# EasyEDA Pro project triple-J UAV 原理图+PCB.epro, board PCB1
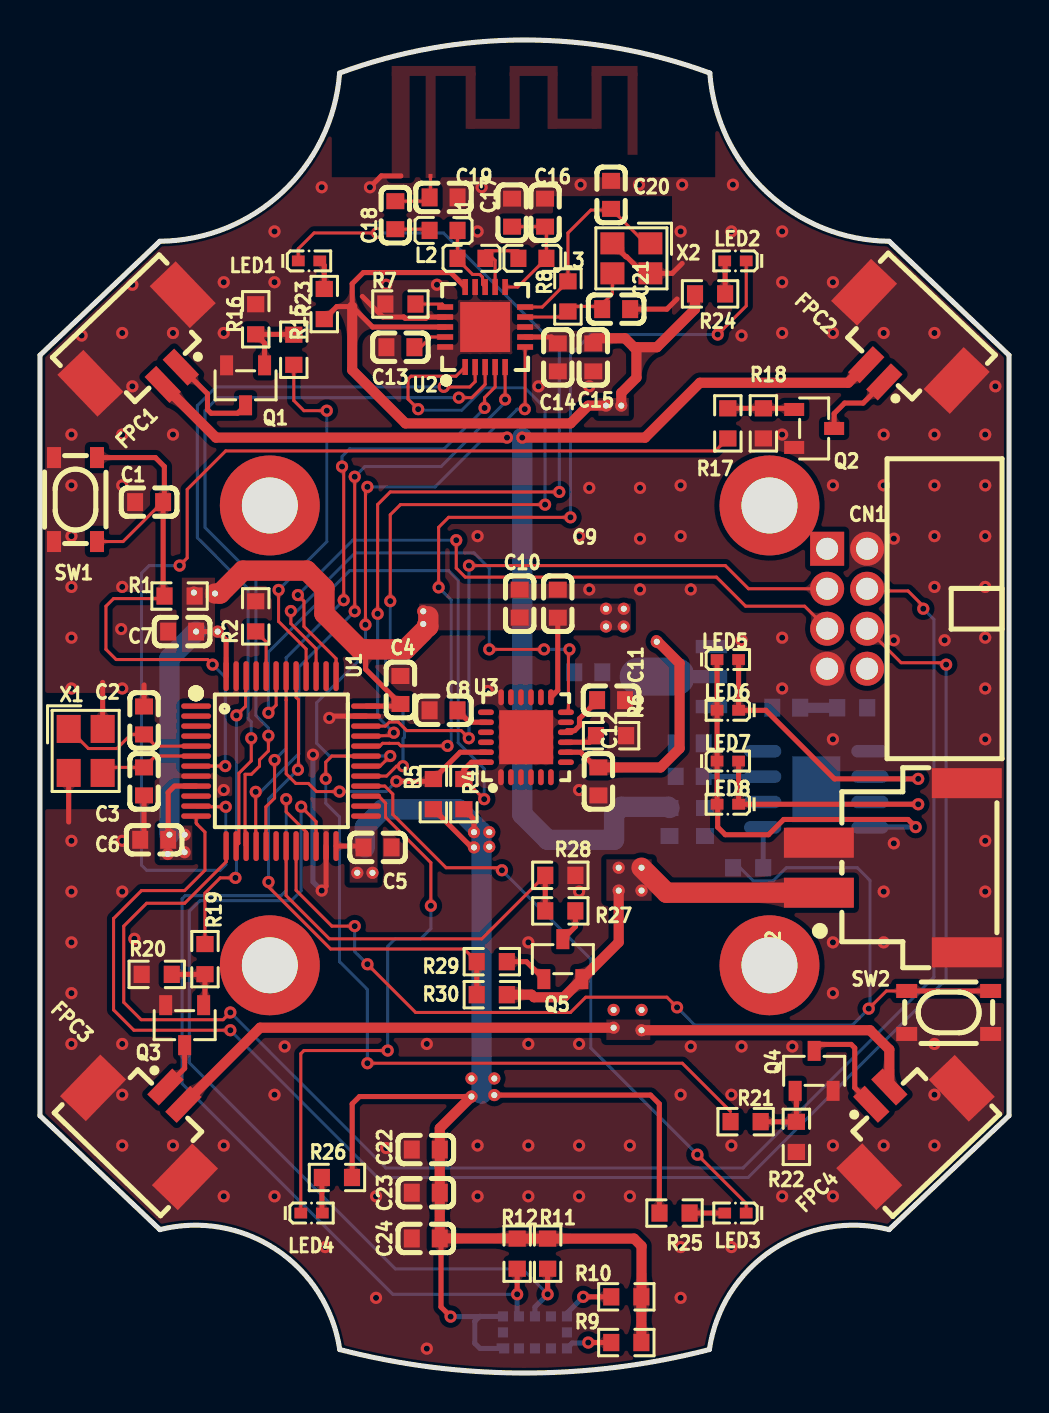
[diagram p13: board, top side]
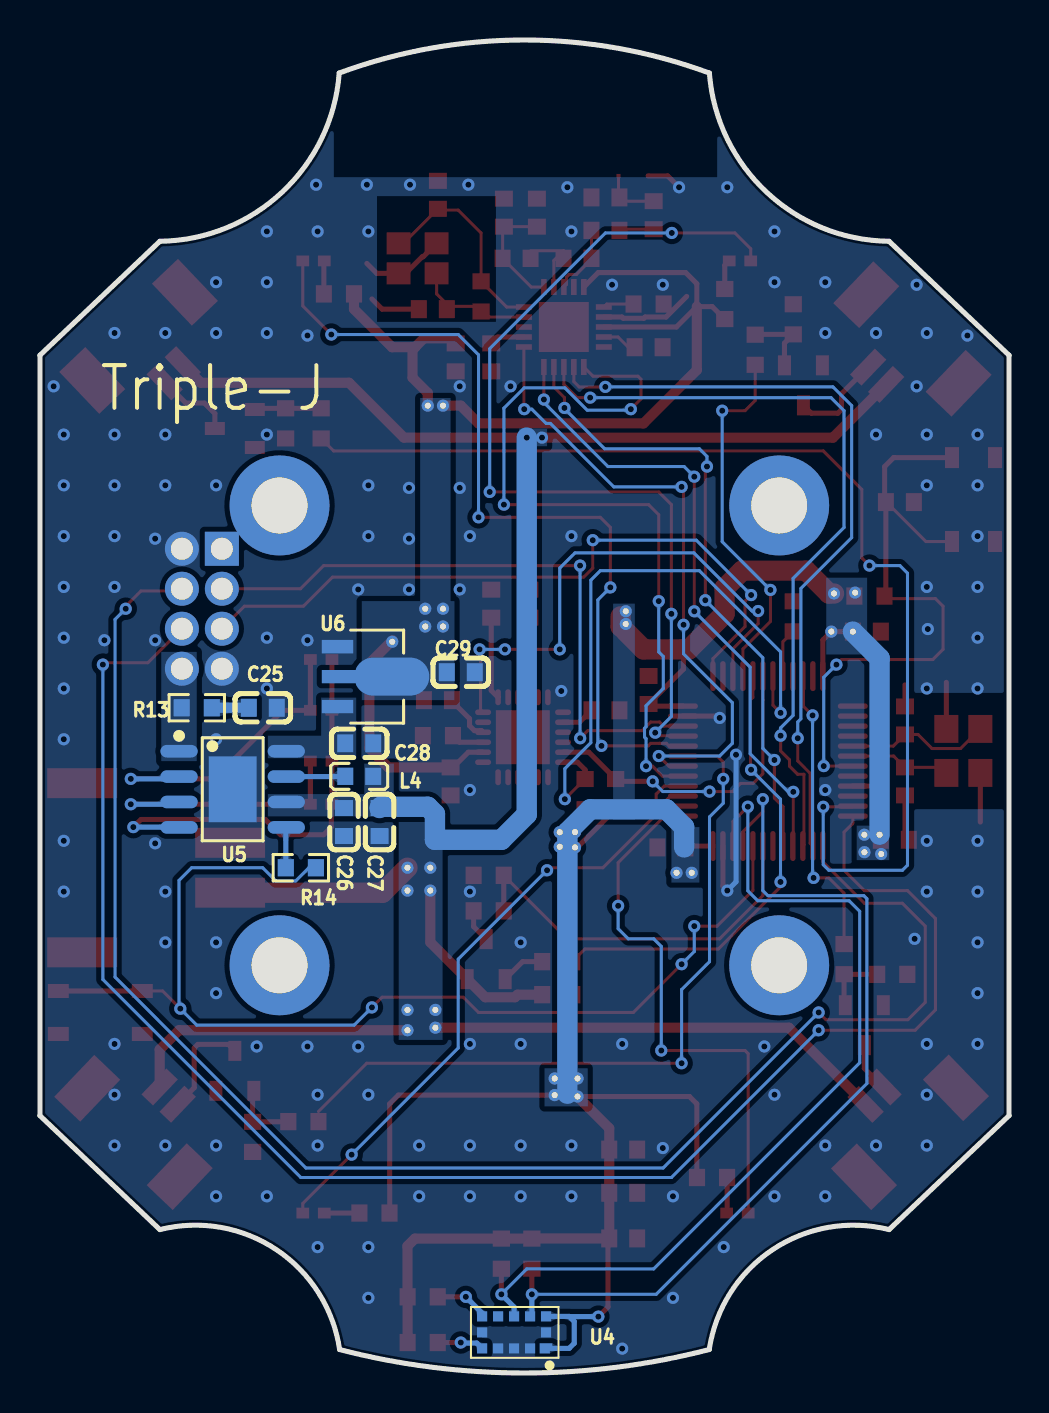
[diagram p14: board, bottom side, seen from below]

Outline 48.49 x 66.68 mm; copper layers: Top Layer, Bottom Layer. Coordinates in mm from the lower left corner of the outline.
Outline path: 0,50.91 6,56.61 arc(12.13,59.07) 14.99,65.02 arc(24.25,66.68) 33.51,65.02 arc(36.36,59.07) 42.49,56.61 48.49,50.91 48.49,12.87 42.49,7.17 arc(36.66,6.17) 33.49,1.17 arc(24.25,0) 15,1.17 arc(11.83,6.17) 6,7.17 0,12.87 0,50.91
Stack: Top Layer 0.035mm / Dielectric1 1.51mm FR4 er 4.5 / Bottom Layer 0.035mm

## Design rules (mm)
spacing copperThickness1oz (default): track to track 0.102, other pairs 0 to 0.3
spacing copperThickness2oz: track to track 0.203, other pairs 0.152 to 0.3
track width copperThickness1oz (default): min 0.127, default 0.254, max 2.54
track width copperThickness2oz: min 0.203, default 0.254, max 2.54
differential pair differentialPair (default): width min 0.127, default 0.254, max 2.54; gap min 0.152, default 0.152
via viaSize (default): diameter min 0.5, default 0.61, max 10; hole min 0.3, default 0.305, max 6.3

## Placement (name value [footprint] x y rotation side)
C1  100nF  [C0603]  5.46 43.56 0 top
C2  12pF  [C0603]  5.21 32.64 90 top
C3  12pF  [C0603]  5.21 29.59 90 top
C4  100nF  [C0603]  18.03 34.16 270 top
C5  100nF  [C0603]  16.89 26.29 180 top
C6  100nF  [C0603]  5.72 26.67 0 top
C7  100nF  [C0603]  7.11 37.08 0 top
C8  10nF  [C0603]  20.19 33.15 180 top
C9  100nF  [C0603]  25.91 38.48 90 top
C10  2.2uF  [C0603]  24 38.48 90 top
C11  100nF  [C0603]  28.57 33.66 180 top
C12  10nF  [C0603]  27.94 29.59 270 top
C13  33nF  [C0603]  18.03 51.31 0 top
C14  100nF  [C0603]  25.91 50.8 90 top
C15  10nF  [C0603]  27.69 50.8 90 top
C16  2.2nF  [C0603]  25.27 58.04 270 top
C17  4.7pF  [C0603]  23.62 58.04 270 top
C18  1.5pF  [C0603]  17.78 57.91 270 top
C19  1pF  [C0603]  20.19 58.8 0 top
C20  22pF  [C0603]  28.57 58.93 90 top
C21  22pF  [C0603]  28.83 53.21 180 top
C22  1pF  [C0603]  19.3 11.18 0 top
C23  100nF  [C0603]  19.3 9.02 0 top
C24  4.7uF  [C0603]  19.3 6.73 0 top
C25  2.2uF  [C0603]  37.34 33.27 180 bottom
C26  10uF  [C0603]  33.27 27.56 90 bottom
C27  10uF  [C0603]  31.5 27.56 90 bottom
C28  10uF  [C0603]  32.51 31.5 0 bottom
C29  10uF  [C0603]  27.43 35.05 180 bottom
CN1  3111-08RG0BK00T1  [CONN-TH_3111-08RG0BK00T1]  40.39 38.23 270 top
CN2  ZX-XH2.54-2PWT  [CONN-SMD_2P-P2.54_MEGASTAR_ZX-XH2.54-2PWT]  42.67 25.27 90 top
FPC1  1.25-2PWB  [CONN-SMD_2P-P1.25_DEALON_1.25-2PWB]  5.72 50.8 223.8 top
FPC2  1.25-2PWB  [CONN-SMD_2P-P1.25_DEALON_1.25-2PWB]  42.67 50.93 136.4 top
FPC3  1.25-2PWB  [CONN-SMD_2P-P1.25_DEALON_1.25-2PWB]  5.84 12.95 315.9 top
FPC4  1.25-2PWB  [CONN-SMD_2P-P1.25_DEALON_1.25-2PWB]  42.93 12.95 43.7 top
L1  3.9nH  [L0603]  20.19 57.15 180 top
L2  8.2nH  [L0603]  21.59 55.75 180 top
L3  2.7nH  [L0603]  24.64 55.75 0 top
L4  1.5uH  [L0603]  32.51 29.85 180 bottom
LED1  XL-1005UYC  [LED0402-FD_YELLOW]  13.46 55.63 180 top
LED2  XL-1005UYC  [LED0402-FD_YELLOW]  34.8 55.63 0 top
LED3  XL-1005UYC  [LED0402-FD_YELLOW]  34.8 8 0 top
LED4  XL-1005UYC  [LED0402-FD_YELLOW]  13.59 8 180 top
LED5  XL-1005UYC  [LED0402-FD_YELLOW]  34.42 35.69 180 top
LED6  XL-1005UYC  [LED0402-FD_YELLOW]  34.42 33.15 0 top
LED7  XL-1005UYC  [LED0402-FD_YELLOW]  34.42 30.61 180 top
LED8  XL-1005UYC  [LED0402-FD_YELLOW]  34.42 28.45 0 top
NOREF  -  [Pad_e605]  28.32 48.39 0 top
NOREF#2  -  [Pad_e420]  7.81 37.08 0 top
NOREF#3  -  [Pad_e526]  21.59 13.83 0 top
NOREF#4  -  [Pad_e929]  19.18 37.47 0 top
NOREF#5  -  [Pad_e520]  21.72 27.05 0 top
NOREF#6  -  [Pad_e416]  7.23 26.05 0 top
NOREF#7  -  [Pad_e434]  29.21 37.34 0 top
NOREF#8  -  [Pad_e415]  6.4 25.96 0 top
NOREF#9  -  [Pad_e928]  19.18 38.1 0 top
NOREF#10  -  [Pad_e950]  28.32 37.34 0 top
NOREF#11  -  [Pad_e527]  22.73 14.73 0 top
NOREF#12  -  [Pad_e456]  30.1 25.27 0 top
NOREF#13  -  [Pad_e500]  28.7 17.27 0 top
NOREF#14  -  [Pad_e421]  8.89 37.08 0 top
NOREF#15  -  [Pad_e501]  30.1 17.15 0 top
NOREF#16  -  [Pad_e525]  21.59 14.73 0 top
NOREF#17  -  [Pad_e916]  16.64 25.02 0 top
NOREF#18  -  [Pad_e606]  29.08 48.39 0 top
NOREF#19  -  [Pad_e454]  28.96 24.13 0 top
NOREF#20  -  [Pad_e915]  15.88 25.02 0 top
NOREF#21  -  [Pad_e418]  7.7 39.03 0 top
NOREF#22  -  [Pad_e455]  30.1 24.13 0 top
NOREF#23  -  [Pad_e432]  30.86 36.58 0 top
NOREF#24  -  [Pad_e522]  22.48 27.05 0 top
NOREF#25  -  [Pad_e380]  36.5 20.39 0 top
NOREF#26  -  [Pad_e1070]  19.54 59.88 90 top
NOREF#27  -  [Pad_e457]  28.96 25.27 0 top
NOREF#28  -  [Pad_e378]  11.5 43.39 0 top
NOREF#29  -  [Pad_e417]  7.24 26.92 0 top
NOREF#30  -  [Pad_e523]  22.48 26.32 0 top
NOREF#31  -  [Pad_e521]  21.72 26.29 0 top
NOREF#32  -  [Pad_e503]  30.1 18.16 0 top
NOREF#33  -  [Pad_e377]  11.5 20.39 0 top
NOREF#34  -  [Pad_e414]  6.48 26.92 0 top
NOREF#35  -  [Pad_e433]  28.32 38.23 0 top
NOREF#36  -  [Pad_e419]  8.76 38.99 0 top
NOREF#37  -  [Pad_e431]  29.21 38.23 0 top
NOREF#38  -  [Pad_e502]  28.7 18.16 0 top
NOREF#39  -  [Pad_e379]  36.5 43.39 0 top
NOREF#40  -  [Pad_e528]  22.73 13.9 0 top
NOREF#41  -  [Pad_e1069]  18.06 59.88 90 top
Q1  AO3400A  [SOT-23-3_L2.9-W1.3-P1.90-LS2.4-BR]  10.29 49.4 90 top
Q2  AO3400A  [SOT-23-3_L2.9-W1.3-P1.90-LS2.4-BR]  38.74 47.24 180 top
Q3  AO3400A  [SOT-23-3_L2.9-W1.3-P1.90-LS2.4-BR]  7.24 17.4 90 top
Q4  AO3400A  [SOT-23-3_L2.9-W1.3-P1.90-LS2.4-BR]  38.74 15.11 270 top
Q5  SI2301A  [SOT-23-3_L2.9-W1.3-P1.90-LS2.4-BR]  26.16 20.7 270 top
R1  10K  [R0603]  6.98 38.86 0 top
R2  10K  [R0603]  10.79 37.85 90 top
R4  10K  [R0603]  21.21 28.96 270 top
R5  10K  [R0603]  19.69 28.96 270 top
R6  10K  [R0603]  28.57 31.88 180 top
R7  22K  [R0603]  18.03 53.47 180 top
R8  10K  [R0603]  26.42 53.85 90 top
R9  10K  [R0603]  29.34 1.52 180 top
R10  10K  [R0603]  29.34 3.81 180 top
R11  10K  [R0603]  25.4 5.97 270 top
R12  10K  [R0603]  23.88 5.97 270 top
R13  1.5  [R0603]  40.64 33.27 180 bottom
R14  10K  [R0603]  35.43 25.27 180 bottom
R15  1K  [R0603]  12.7 51.18 90 top
R16  10K  [R0603]  10.79 52.71 270 top
R17  1K  [R0603]  34.42 47.5 90 top
R18  10K  [R0603]  36.19 47.5 90 top
R19  1K  [R0603]  8.25 20.7 270 top
R20  10K  [R0603]  5.84 19.94 0 top
R21  1K  [R0603]  35.31 12.57 0 top
R22  10K  [R0603]  37.85 11.81 90 top
R23  10K  [R0603]  14.22 53.47 270 top
R24  10K  [R0603]  33.53 53.98 180 top
R25  10K  [R0603]  31.75 8 180 top
R26  10K  [R0603]  14.86 9.78 0 top
R27  100K  [R0603]  26.03 23.11 0 top
R28  100K  [R0603]  26.03 24.89 180 top
R29  1K  [R0603]  22.61 20.57 180 top
R30  100K  [R0603]  22.61 18.92 180 top
SW1  SKRPACE010  [KEY-SMD_4P-L4.2-W3.2-P2.20-LS4.6]  1.78 43.69 270 top
SW2  SKRPACE010  [KEY-SMD_4P-L4.2-W3.2-P2.20-LS4.6]  45.47 18.03 0 top
U1  STM32F103C8T6  [LQFP-48_L7.0-W7.0-P0.50-LS9.0-BL]  12.06 30.61 270 top
U2  Si24R1  [QFN-20_L4.0-W4.0-P0.50-BL-EP]  22.27 52.32 0 top
U3  MPU-6050  [QFN-24_L4.0-W4.0-P0.50-BL-EP2.7]  24.31 31.8 0 top
U4  VL53L4CDV0DH/1  [LGA-12_L4.4-W2.4_VL53L0X]  24.76 2.03 180 bottom
U5  TP4336  [ESOP-8_L4.9-W3.9-P1.27-LS6.0-BL-EP-1]  38.84 29.2 270 bottom
U6  AMS1117-3.3VSOT-89  [SOT-89-3_L4.5-W2.5-P1.50-LS4.2-BR]  32.24 34.83 0 bottom
X1  8MHz  [CRYSTAL-SMD_4P-L3.2-W2.5-BL]  2.29 31.12 270 top
X2  16MHz  [CRYSTAL-SMD_4P-L2.5-W2.0-BL-2]  29.59 55.75 180 top

## Footprints (pads in the part's own frame, mm; a bottom-side part is the same pattern mirrored in y, then rotated)
C0603
  rect 0.8x0.9 smd: 1(-0.7,0) 2(0.7,0)
CONN-SMD_2P-P1.25_DEALON_1.25-2PWB
  rect 0.8x1.8 smd: 1(-0.625,1.275) 2(0.625,1.275)
  rect 1.8x2.9 smd: 3(-3.2,-1.275) 4(3.2,-1.275)
CONN-SMD_2P-P2.54_MEGASTAR_ZX-XH2.54-2PWT
  rect 1.5x3.5 smd: 1(-1.25,3.7) 2(1.25,3.7) 3(-4.23,-3.7) 4(4.23,-3.7)
CONN-TH_3111-08RG0BK00T1
  rect 1.7x1.7 hole 1.1: 1(-3,-1)
  round 1.7 hole 1.1: 2(-3,1) 3(-1,-1) 4(-1,1) 5(1,-1) 6(1,1) 7(3,-1) 8(3,1)
CRYSTAL-SMD_4P-L2.5-W2.0-BL-2
  rect 1.2x1.1 smd: 1(-0.95,-0.75) 2(0.95,-0.75) 3(0.95,0.75) 4(-0.95,0.75)
CRYSTAL-SMD_4P-L3.2-W2.5-BL
  rect 1.4x1.2 smd: 1(-1.1,-0.85) 2(1.1,-0.85) 3(1.1,0.85) 4(-1.1,0.85)
ESOP-8_L4.9-W3.9-P1.27-LS6.0-BL-EP-1
  oval 0.63x1.865 smd: 1(-1.905,-2.683) 2(-0.635,-2.683) 3(0.635,-2.683) 4(1.905,-2.683) 5(1.905,2.683) 6(0.635,2.683) 7(-0.635,2.683) 8(-1.905,2.683)
  rect 3.3x2.4 smd: 9(0,0)
KEY-SMD_4P-L4.2-W3.2-P2.20-LS4.6
  rect 1.05x0.7 smd: 1(-2.1,1.075) 2(2.1,1.075) 3(-2.1,-1.075) 4(2.1,-1.075)
L0603
  rect 0.8x0.864 smd: 1(-0.7,0) 2(0.7,0)
LED0402-FD_YELLOW
  rect 0.636x0.54 smd: 1(-0.538,0) 2(0.538,0)
LGA-12_L4.4-W2.4_VL53L0X
  custom 0.635x0.508 smd: 1(1.6,-0.8)
  rect 0.508x0.508 smd: 2(0.8,-0.8) 3(0,-0.8) 4(-0.8,-0.8) 5(-1.6,-0.8) 6(-1.6,0) 7(-1.6,0.8) 8(-0.8,0.8) 9(0,0.8) 10(0.8,0.8) 11(1.6,0.8) 12(1.6,0)
LQFP-48_L7.0-W7.0-P0.50-LS9.0-BL
  oval 0.27x1.5 smd: 1(-2.75,-4.25) 2(-2.25,-4.25) 3(-1.75,-4.25) 4(-1.25,-4.25) 5(-0.75,-4.25) 6(-0.25,-4.25) 7(0.25,-4.25) 8(0.75,-4.25) 9(1.25,-4.25) 10(1.75,-4.25) 11(2.25,-4.25) 12(2.75,-4.25) 25(2.75,4.25) 26(2.25,4.25) 27(1.75,4.25) 28(1.25,4.25) 29(0.75,4.25) 30(0.25,4.25) 31(-0.25,4.25) 32(-0.75,4.25) 33(-1.25,4.25) 34(-1.75,4.25) 35(-2.25,4.25) 36(-2.75,4.25)
  oval 1.5x0.27 smd: 13(4.25,-2.75) 14(4.25,-2.25) 15(4.25,-1.75) 16(4.25,-1.25) 17(4.25,-0.75) 18(4.25,-0.25) 19(4.25,0.25) 20(4.25,0.75) 21(4.25,1.25) 22(4.25,1.75) 23(4.25,2.25) 24(4.25,2.75) 37(-4.25,2.75) 38(-4.25,2.25) 39(-4.25,1.75) 40(-4.25,1.25) 41(-4.25,0.75) 42(-4.25,0.25) 43(-4.25,-0.25) 44(-4.25,-0.75) 45(-4.25,-1.25) 46(-4.25,-1.75) 47(-4.25,-2.25) 48(-4.25,-2.75)
Pad_e377
  round 5 hole 2.8: 1(0,0)
Pad_e378
  round 5 hole 2.8: 1(0,0)
Pad_e379
  round 5 hole 2.8: 1(0,0)
Pad_e380
  round 5 hole 2.8: 1(0,0)
Pad_e414
  round 0.61 hole 0.305: 1(0,0)
Pad_e415
  round 0.61 hole 0.305: 1(0,0)
Pad_e416
  round 0.61 hole 0.305: 1(0,0)
Pad_e417
  round 0.61 hole 0.305: 1(0,0)
Pad_e418
  round 0.61 hole 0.305: 1(0,0)
Pad_e419
  round 0.61 hole 0.305: 1(0,0)
Pad_e420
  round 0.61 hole 0.305: 1(0,0)
Pad_e421
  round 0.61 hole 0.305: 1(0,0)
Pad_e431
  round 0.61 hole 0.305: 1(0,0)
Pad_e432
  round 0.61 hole 0.305: 1(0,0)
Pad_e433
  round 0.61 hole 0.305: 1(0,0)
Pad_e434
  round 0.61 hole 0.305: 1(0,0)
Pad_e454
  round 0.61 hole 0.305: 1(0,0)
Pad_e455
  round 0.61 hole 0.305: 1(0,0)
Pad_e456
  round 0.61 hole 0.305: 1(0,0)
Pad_e457
  round 0.61 hole 0.305: 1(0,0)
Pad_e500
  round 0.61 hole 0.305: 1(0,0)
Pad_e501
  round 0.61 hole 0.305: 1(0,0)
Pad_e502
  round 0.61 hole 0.305: 1(0,0)
Pad_e503
  round 0.61 hole 0.305: 1(0,0)
Pad_e520
  round 0.61 hole 0.305: 1(0,0)
Pad_e521
  round 0.61 hole 0.305: 1(0,0)
Pad_e522
  round 0.61 hole 0.305: 1(0,0)
Pad_e523
  round 0.61 hole 0.305: 1(0,0)
Pad_e525
  round 0.61 hole 0.305: 1(0,0)
Pad_e526
  round 0.61 hole 0.305: 1(0,0)
Pad_e527
  round 0.61 hole 0.305: 1(0,0)
Pad_e528
  round 0.61 hole 0.305: 1(0,0)
Pad_e605
  round 0.61 hole 0.305: 1(0,0)
Pad_e606
  round 0.61 hole 0.305: 1(0,0)
Pad_e915
  round 0.61 hole 0.305: 1(0,0)
Pad_e916
  round 0.61 hole 0.305: 1(0,0)
Pad_e928
  round 0.61 hole 0.305: 1(0,0)
Pad_e929
  round 0.61 hole 0.305: 1(0,0)
Pad_e950
  round 0.61 hole 0.305: 1(0,0)
Pad_e1069
  rect 0.2x0.2 smd: 2(0,0)
Pad_e1070
  rect 0.201x0.2 smd: 1(0,0)
QFN-20_L4.0-W4.0-P0.50-BL-EP
  rect 0.28x0.8 smd: 1(-1,-2) 2(-0.5,-2) 3(0,-2) 4(0.5,-2) 5(1,-2) 11(1,2) 12(0.5,2) 13(0,2) 14(-0.5,2) 15(-1,2)
  rect 0.8x0.28 smd: 6(2,-1) 7(2,-0.5) 8(2,0) 9(2,0.5) 10(2,1) 16(-2,1) 17(-2,0.5) 18(-2,0) 19(-2,-0.5) 20(-2,-1)
  rect 2.5x2.5 smd: 21(0,0)
QFN-24_L4.0-W4.0-P0.50-BL-EP2.7
  oval 0.28x0.8 smd: 1(-1.25,-2) 2(-0.75,-2) 3(-0.25,-2) 4(0.25,-2) 5(0.75,-2) 6(1.25,-2) 13(1.25,2) 14(0.75,2) 15(0.25,2) 16(-0.25,2) 17(-0.75,2) 18(-1.242,2)
  oval 0.8x0.28 smd: 7(2,-1.25) 8(2,-0.75) 9(2,-0.25) 10(2,0.25) 11(2,0.75) 12(2,1.25) 19(-2,1.25) 20(-2,0.75) 21(-2,0.25) 22(-2,-0.25) 23(-2,-0.75) 24(-2,-1.25)
  rect 2.7x2.7 smd: 25(0.013,0)
R0603
  rect 0.806x0.864 smd: 1(-0.753,0) 2(0.753,0)
SOT-23-3_L2.9-W1.3-P1.90-LS2.4-BR
  rect 1x0.65 smd: 1(1,-0.95) 2(1,0.95) 3(-1,0)
SOT-89-3_L4.5-W2.5-P1.50-LS4.2-BR
  rect 1.575x0.672 smd: 1(1.356,-1.5) 3(1.356,1.5)
  custom 5.377x1.9 smd: 2(-1.356,0)

## Nets
As in the schematic, except:
3V3: C4.2 C5.2 C6.2 C7.2 C9.1 C10.1 C12.1 C14.2 C15.2 C22.2 C23.2 C24.2 C29.1 NOREF.1 NOREF#2.1 NOREF#3.1 NOREF#4.1 NOREF#5.1 NOREF#6.1 NOREF#7.1 NOREF#8.1 NOREF#9.1 NOREF#10.1 NOREF#11.1 NOREF#14.1 NOREF#16.1 NOREF#17.1 NOREF#18.1 NOREF#20.1 NOREF#21.1 NOREF#23.1 NOREF#24.1 NOREF#29.1 NOREF#30.1 NOREF#31.1 NOREF#34.1 NOREF#35.1 NOREF#36.1 NOREF#37.1 NOREF#40.1 R1.2 R4.2 R5.2 R9.1 R10.1 R11.1 R12.1 R23.2 R24.2 R25.2 R26.2 U1.9 U1.24 U1.36 U1.48 U2.7 U2.15 U2.18 U3.8 U3.13 U4.1 U4.11 U6.2
GND: C1.1 C2.2 C3.1 C4.1 C5.1 C6.1 C7.1 C8.2 C9.2 C10.2 C11.1 C12.2 C13.1 C14.1 C15.1 C16.1 C17.1 C19.2 C20.2 C21.1 C22.1 C23.1 C24.1 C25.2 C26.1 C27.1 C28.1 C29.2 CN1.2 CN1.7 CN2.2 CN2.3 CN2.4 FPC1.3 FPC1.4 FPC2.3 FPC2.4 FPC3.3 FPC3.4 FPC4.3 FPC4.4 NOREF#41.2 Q1.2 Q2.2 Q3.2 Q4.2 R2.2 R6.1 R7.2 R16.1 R18.1 R20.1 R22.1 R28.1 SW1.3 SW1.4 SW2.3 SW2.4 U1.8 U1.23 U1.35 U1.47 U2.8 U2.14 U2.17 U2.20 U2.21 U3.1 U3.11 U3.18 U3.25 U4.2 U4.3 U4.4 U4.6 U4.12 U5.9 U6.1 X1.2 X1.4 X2.2 X2.4
VBAT: C26.2 C27.2 CN2.1 FPC1.2 FPC2.2 FPC3.2 FPC4.2 L4.2 NOREF#12.1 NOREF#13.1 NOREF#15.1 NOREF#19.1 NOREF#22.1 NOREF#27.1 NOREF#32.1 NOREF#38.1 Q5.2 R30.1 U5.6
AT1: C18.1 C19.1 NOREF#26.1
$1N37: R2.1 U1.44

Pads without a net: CN1 1; NOREF#25 1; NOREF#28 1; NOREF#33 1; NOREF#39 1; U1 1 2 3 4 10 18 25 26 38 45; U3 2 3 4 5 6 7 14 15 16 17 19 21 22; U4 8

## Via types
v1: diameter 0.61, hole 0.305, Top Layer to Bottom Layer, 216 vias

## Routing (per net, layer and track width the routed paths; a pad name or vN(x,y) marks a point on that pad's centre or on a via; arc(x,y) is an arc through that point)
3V3: length 179.9
  Top Layer w0.254: 15.62,53.34 14.85,53.34 R23.2 ; 15.62,53.34 16.64,52.32 U2.18 ; 15.62,53.34 15.62,54.48 16.18,55.04 20.55,55.04 U2.15 ; 27.81,30.29 27.05,31.05 U3.8 ; C5.2 16.12,26.36 U1.24 ; NOREF#2.1 NOREF#14.1 9.31,36.66 U1.48 ; C9.1 25.91,34.14 U3.13 ; 24.27,51.82 25.59,51.82 C14.2 ; R5.2 21.6,26.29 NOREF#31.1 ; U1.36 17.93,33.36 C4.2 16.29,35.2 16.29,36.2 ; v1(20.55,2.82) 20.07,3.3 20.07,6.67 C24.2 ; R25.2 30.99,8.01 30.99,13.46 30.55,13.9 NOREF#40.1 ; NOREF#5.1 21.72,27.69 R4.2 ; NOREF#3.1 15.99,13.83 15.62,13.46 15.62,9.79 R26.2 ; C6.2 6.42,29.04 6.73,29.36 U1.9
  Top Layer w0.508: NOREF.1 27.43,48.39 26.54,47.5 18.29,47.5 15.62,50.17 15.62,53.34 ; 29.72,51.31 29.27,51.75 27.69,51.75 ; 29.72,51.31 29.84,51.31 ; 29.72,51.31 29.84,51.18 ; R24.2 32.77,53.22 30.87,51.31 29.84,51.31 ; NOREF#18.1 29.08,49.02 29.84,49.78 29.84,51.18 ; 29.84,51.31 29.84,51.18 ; R9.1 R10.1 30.1,3.82 30.1,6.35 29.73,6.72 R11.1 R12.1 23.87,6.73 C24.2 C23.2 C22.2 20,12.24 NOREF#3.1 ; 27.94,30.29 31.05,30.29 32,31.24 32,35.49 30.84,36.66
  Top Layer w1.016: NOREF#36.1 9.01,38.99 10.15,40.13 13.35,40.13 14.23,39.25 14.23,37.97 16.01,36.2 18.29,36.2 19.18,37.08 ; 19.37,37.27 19.43,37.34 19.43,37.85
  Bottom Layer w0.254: 22,2.82 21.75,2.58 21.75,1.49 22.01,1.23 23.16,1.23 ; 22,2.82 v1(20.55,2.82) ; 22,2.82 22.01,2.83 U4.11
  Bottom Layer w1.016: NOREF#2.1 6.48,35.75 NOREF#34.1 ; 16.26,26.29 16.26,27.31 17.15,28.19 20.96,28.19 22.1,27.05 22.1,13.97
GND: length 32.6
  Top Layer w0.254: U1.23 14.31,24.35 v1(14.1,24.13) ; 28.64,56.5 29.31,55.83 29.36,55.83 30.19,55 X2.4 31.63,55 32.13,55.5 ; C3.1 5.21,26.86 C6.1 ; U1.35 14.57,32.86 v1(14.48,32.77) ; C2.2 5.21,34.42 ; v1(16.51,59.31) 17.08,59.88 NOREF#41.2 ; X1.2 1.44,27.56 ; 16.13,53.85 17.16,52.82 18.21,52.82 18.27,52.76 19.31,52.76 19.37,52.82 U2.17 ; C21.1 31.37,53.21 31.88,53.72 ; X1.4 3.14,34.54
  Bottom Layer w0.254: v1(13.66,30.93) 13.66,24.57 v1(14.1,24.13)
  vias: v1(1.58,46.94) v1(1.58,44.4) v1(1.58,41.86) v1(1.58,39.32) v1(1.58,36.78) v1(1.58,34.24) v1(1.58,26.62) v1(1.58,24.08) v1(1.58,21.54) v1(1.58,19) v1(1.58,16.46) v1(2.08,51.89) v1(4.11,52.02) v1(4.11,46.94) v1(4.11,44.4) v1(4.11,39.32) v1(4.06,37.21) v1(4.11,34.24) v1(4.11,26.62) v1(4.11,24.08) v1(4.11,16.46) v1(4.11,13.92) v1(4.11,11.38) v1(4.62,54.43) v1(4.62,49.35) v1(4.72,21.72) v1(6.66,52.02) v1(6.66,46.94) v1(6.66,11.38) v1(9.19,54.56) v1(9.19,52.02) v1(9.19,29.16) v1(9.19,11.38) v1(9.19,8.84) v1(11.74,57.1) v1(11.74,54.56) v1(11.74,13.92) v1(11.74,8.84) v1(12.24,16.33) v1(14.1,59.31) v1(14.28,6.3) v1(16.81,8.84) v1(16.81,3.76) v1(17.32,54.43) v1(17.32,11.25) v1(19.35,16.46) v1(19.35,1.22) v1(19.86,54.43) v1(21.9,57.1) v1(21.9,41.86) v1(21.9,11.38) v1(21.9,8.84) v1(22.1,59.31) v1(22.4,34.11) v1(24.44,21.54) v1(24.44,16.46) v1(24.44,11.38) v1(24.44,8.84) v1(24.94,49.35) v1(26.97,41.86) v1(26.97,29.16) v1(26.97,24.08) v1(26.97,16.46) v1(26.97,11.38) v1(26.97,8.84) v1(27.05,59.44) v1(27.48,49.35) v1(27.48,44.27) v1(27.48,39.19) v1(29.51,11.38) v1(29.51,8.84) v1(29.97,59.44) v1(30.02,44.27) v1(30.02,41.73) v1(30.02,39.19) v1(32.13,59.44) v1(32.06,57.1) v1(32.06,44.4) v1(32.06,41.86) v1(32.06,13.92) v1(32.06,6.3) v1(32.06,3.76) v1(32.56,39.19) v1(32.56,16.33) v1(34.59,57.1) v1(34.59,13.92) v1(34.59,11.38) v1(34.59,6.3) v1(34.67,59.44) v1(35.1,51.89) v1(35.1,36.65) v1(35.1,16.33) v1(37.13,57.1) v1(37.13,54.56) v1(37.13,52.02) v1(37.13,46.94) v1(37.13,36.78) v1(37.13,34.24) v1(37.13,8.84) v1(37.64,16.33) v1(39.68,54.56) v1(39.68,52.02) v1(39.68,44.4) v1(39.68,31.7) v1(39.68,21.54) v1(39.68,19) v1(39.68,11.38) v1(39.68,8.84) v1(42.22,52.02) v1(42.22,46.94) v1(42.22,44.4) v1(42.22,24.08) v1(42.22,21.54) v1(42.22,11.38) v1(42.72,41.73) v1(42.72,36.65) v1(42.72,26.49) v1(44.75,52.02) v1(44.75,46.94) v1(44.75,44.4) v1(44.75,41.86) v1(44.75,39.32) v1(44.75,16.46) v1(44.75,13.92) v1(44.75,11.38) v1(45.26,36.65) v1(47.29,46.94) v1(47.29,44.4) v1(47.29,41.86) v1(47.29,39.32) v1(47.29,36.78) v1(47.29,34.24) v1(47.29,31.7) v1(47.29,26.62) v1(47.29,24.08) v1(47.8,49.35)
VBAT: length 121.7
  Top Layer w0.508: NOREF#13.1 11.01,17.27 7.18,13.44 ; 41.34,50.43 40.44,49.53 33.02,49.53 30.28,46.79 v1(24.13,46.79) ; 30.23,17.15 41.53,17.15 42.5,16.18 42.5,14.31 ; NOREF#19.1 28.96,21.55 Q5.2 26.21,18.8 24.72,18.8 24.59,18.92 R30.1 ; FPC1.2 8.81,46.79 v1(23.37,46.79)
  Top Layer w1.016: NOREF#12.1 31.35,24.02 CN2.1
  Bottom Layer w1.016: v1(24.13,46.79) 24.13,27.94 25.4,26.67 28.72,26.67 28.72,27.96 29.08,28.32 31.43,28.32 C27.2
AT1: length 2.9
  Top Layer w0.152: C18.1 19.3,58.61 19.54,58.85 NOREF#26.1
BAT-ADC-EN: length 24.8
  Top Layer w0.152: v1(11.43,24.56) 11.43,24.32 14.54,21.21 21.22,21.21 R29.2 ; U1.41 12.81,33.79 12.94,33.67 12.94,30.2 v1(12.91,30.17)
  Top Layer w0.254: R30.2 R29.2
  Bottom Layer w0.152: v1(11.43,24.56) 11.43,28.7 v1(12.91,30.17)
BAT_DET: length 19.4
  Top Layer w0.152: U1.19 12.31,23.88 14.48,21.72 22.11,21.72 R28.2
  Top Layer w0.254: R27.1 R28.2
I2C2-SCL: length 45.5
  Top Layer w0.152: U1.21 13.34,26.38 13.34,27.05 12.32,28.07 v1(12.32,28.7)
  Top Layer w0.254: R12.2 v1(23.88,3.94)
  Bottom Layer w0.152: v1(23.88,3.94) 17.65,3.94 7.11,14.48 7.11,23.72 7.26,23.88 12.06,23.88 12.32,24.13 v1(12.32,28.7)
  Bottom Layer w0.254: v1(23.88,3.94) 23.88,2.92 U4.10
I2C2-SDA: length 45.5
  Top Layer w0.152: U1.22 13.81,27.58 v1(13.07,28.33)
  Top Layer w0.254: R11.2 v1(25.4,3.94)
  Bottom Layer w0.152: v1(13.07,28.33) 13.07,24.12 12.57,23.62 8,23.62 7.47,23.09 7.47,15.52 17.78,5.21 24.13,5.21 v1(25.4,3.94)
  Bottom Layer w0.254: U4.9 24.76,3.3 v1(25.4,3.94)
I2C-SCL: length 16.1
  Top Layer w0.152: U1.42 12.31,33.66 12.32,33.66 12.32,29.97 12.8,29.49 13.43,29.49 13.84,29.08 v1(14.99,29.08)
  Top Layer w0.254: U3.23 21.03,31.05 R5.1 19.57,29.59 v1(17.83,29.59)
  Bottom Layer w0.152: v1(17.83,29.59) 17.32,29.08 v1(14.99,29.08)
I2C-SDA: length 31.1
  Top Layer w0.152: U1.43 11.81,33.41 v1(11.43,33.02) ; v1(22.22,28.7) 21.22,29.71 R4.1
  Top Layer w0.254: U3.24 21.59,30.55 21.21,30.17 R4.1
  Bottom Layer w0.152: v1(22.22,28.7) 22.22,30.23 20.92,31.53 20.92,39.65 20.45,40.13 15.49,40.13 11.43,36.07 v1(11.43,33.02)
LED1: length 46.1
  Top Layer w0.152: v1(25.98,44.07) 17.53,44.07 16.89,43.44 v1(16.89,37.97) ; LED1.2 12.92,56.23 13.72,57.02 v1(16.87,57.02) ; U1.33 16.34,31.88 17.55,31.88 v1(17.7,32.03)
  Bottom Layer w0.152: v1(16.89,37.97) 16.89,32.84 v1(17.7,32.03) ; v1(25.98,44.07) 25.98,51.23 20.19,57.02 v1(16.87,57.02)
LED2: length 42.5
  Top Layer w0.152: v1(33.91,51.94) 35.34,53.37 LED2.2 ; v1(26.54,42.8) 20.45,42.8 19.95,42.3 v1(19.95,39.29) ; U1.32 17.01,31.36 17.15,31.5 17.48,31.5 17.48,31.49 17.93,31.49 18.05,31.37 20.44,31.37
  Bottom Layer w0.152: 20.44,31.37 20.57,31.51 20.57,38.67 v1(19.95,39.29) ; v1(26.54,42.8) 26.54,50.93 27.56,51.94 v1(33.91,51.94)
  vias: v1(20.39,31.37)
LED3: length 31.3
  Top Layer w0.152: v1(32.89,10.92) 35.34,8.48 LED3.2 ; v1(23.11,25.15) 22.99,25.27 20.32,25.27 17.65,27.94 17.65,28.96 17.25,29.36 U1.28
  Bottom Layer w0.152: v1(32.89,10.92) 27.56,16.26 27.56,20.7 v1(23.11,25.15)
LED4: length 28.5
  Top Layer w0.152: v1(17.4,16.13) 13.21,16.13 13.05,15.97 LED4.2 ; U1.27 16.94,28.86 17.29,28.51 17.29,27.79 19.56,25.53 v1(19.56,23.37)
  Bottom Layer w0.152: v1(17.4,16.13) 17.4,21.34 17.78,21.72 19.05,21.72 19.56,22.23 v1(19.56,23.37)
LEFT-0: length 18.5
  Top Layer w0.152: v1(14.35,48.13) 13.21,48.13 12.7,48.64 R15.1 ; U1.40 13.31,36.22 11.94,37.59 v1(11.94,39.17)
  Bottom Layer w0.152: v1(11.94,39.17) 14.35,41.58 v1(14.35,48.13)
LEFT-1: length 14.7
  Top Layer w0.152: v1(9.83,32.89) 10.29,33.35 10.29,34.83 U1.46 ; R19.1 8.25,24 9.02,24.77 v1(9.78,24.77)
  Bottom Layer w0.152: v1(9.78,24.77) 9.83,24.82 v1(9.83,32.89)
MPU_INT: length 26.4
  Top Layer w0.152: v1(12.55,38.11) 12.55,37.49 13.81,36.22 U1.39 ; 26.44,36.2 26.44,33.18 U3.12 ; v1(25.22,36.2) v1(22.48,36.2)
  Bottom Layer w0.152: 26.44,36.2 v1(25.22,36.2) ; v1(22.48,36.2) 22.48,40.26 21.72,41.02 15.77,41.02 12.86,38.11 v1(12.55,38.11)
  vias: v1(26.49,36.2)
NRST: length 32
  Top Layer w0.152: C1.2 6.13,43.56 4.16,41.59 2.85,41.59 ; U1.7 v1(9.27,30.36) ; R1.1 6.1,38.74 3.68,38.74 3.3,38.35 3.3,36.2 3.81,35.69 8.38,35.69 v1(8.64,35.43)
  Top Layer w0.254: 2.85,45.79 5.77,45.79 6.22,45.34 6.22,43.62 C1.2 6.16,38.93 R1.1
  Bottom Layer w0.152: v1(9.27,30.36) 9.27,34.8 v1(8.64,35.43)
OSC_IN: length 7.3
  Top Layer w0.152: U1.5 5.79,31.36 C2.1 4.55,31.94 3.85,31.24 2.42,31.24 1.44,32.22 X1.1
OSC_OUT: length 5
  Top Layer w0.152: X1.3 3.41,30.29 C3.2 5.77,30.86 U1.6
PA1: length 57.6
  Top Layer w0.152: U1.11 7.85,28.32 v1(9.3,28.32) ; v1(6.98,40.39) 7.37,40.77 7.37,44.2 9.29,46.12 33.79,46.12 R17.1
  Bottom Layer w0.152: v1(6.98,40.39) 5.46,40.39 5.08,40.01 5.08,25.4 5.33,25.15 9.02,25.15 9.3,25.43 v1(9.3,28.32)
PA2: length 82.7
  Top Layer w0.152: CN1.6 43.09,35.53 45.25,35.53 v1(45.34,35.43) ; U1.12 7.81,27.51 7.85,27.47 7.85,27.46 8.25,27.05 8.25,25.15 7.24,24.13 5.08,24.13 3.68,22.73 3.68,18.16 4.7,17.15 v1(9.53,17.15)
  Bottom Layer w0.152: v1(45.34,35.43) 45.34,19.69 35.43,9.78 16.89,9.78 v1(9.53,17.15)
PA3: length 81.2
  Top Layer w0.152: U1.13 9.31,25.57 7.24,23.5 5.33,23.5 4.19,22.35 4.19,18.54 5.06,17.67 9.16,17.67 v1(9.53,18.03) ; CN1.4 41.5,39.12 43.43,39.12 44.2,38.35 v1(44.2,38.23)
  Bottom Layer w0.152: v1(44.2,38.23) 44.73,37.69 44.73,19.81 35.18,10.25 17.31,10.25 v1(9.53,18.03)
PA4: length 38.6
  Top Layer w0.152: U2.2 21.77,49.59 21.51,49.32 20.21,49.32 v1(20.2,49.33) ; v1(10.57,31.75) 10.57,30.62 9.95,30 9.95,26.49 U1.14
  Bottom Layer w0.152: v1(10.57,31.75) 10.57,32.57 10.41,32.72 10.41,39.24 7.87,41.78 7.87,48.39 8.81,49.33 v1(20.2,49.33)
PA5: length 39.2
  Top Layer w0.152: U2.3 22.27,49.45 21.61,48.79 v1(20.96,48.79) ; U1.15 10.26,26.41 10.26,29.95 10.58,29.95 10.98,30.35 10.98,30.67 11.43,31.12 v1(11.43,31.88)
  Bottom Layer w0.152: v1(20.96,48.79) 8.91,48.79 8.25,48.13 8.25,42.29 10.8,39.74 10.8,32.89 11.43,32.27 v1(11.43,31.88)
PA6: length 31.5
  Top Layer w0.152: U1.16 10.79,26.38 v1(10.79,29.07) ; U2.5 23.27,48.69 ; v1(15.75,44.83) v1(15.75,38.1)
  Bottom Layer w0.152: v1(10.79,29.07) 11.05,29.07 12.95,30.98 12.95,35.31 v1(15.75,38.1) ; v1(15.75,44.83) 16.26,45.34 20.07,45.34 23.27,48.55 v1(23.27,48.69)
PA7: length 31.6
  Top Layer w0.152: v1(11.74,30.66) 11.74,28.76 11.3,28.32 11.3,26.37 U1.17 ; v1(22.25,48.27) 22.25,48.79 22.77,49.32 U2.4 ; v1(15.11,45.34) 15.2,45.26 v1(15.2,38.65)
  Bottom Layer w0.152: v1(15.11,45.34) 15.11,45.85 15.49,46.23 20.23,46.23 22.25,48.24 v1(22.25,48.27) ; v1(15.2,38.65) 12.32,35.78 12.32,31.24 v1(11.74,30.66)
PA8: length 40
  Top Layer w0.152: v1(25.27,43.43) 18.03,43.43 17.53,42.93 v1(17.53,38.61) ; U2.1 20.81,49.86 18.57,49.86 18.41,49.71 18.41,48.72 v1(18.92,48.21) ; U1.29 17.34,29.86 17.84,30.35 v1(18.16,30.35)
  Bottom Layer w0.152: v1(18.16,30.35) 18.16,31.73 18.24,31.81 18.24,32.25 18.16,32.32 18.16,33.37 17.3,34.24 17.3,35.84 17.53,36.07 v1(17.53,38.61) ; 18.92,48.16 21.11,48.16 22.22,49.28 24.26,49.28 25.27,48.26 v1(25.27,43.43)
PA9: length 31.8
  Top Layer w0.152: v1(17.53,30.86) 17.02,30.36 U1.30 ; v1(24.26,48.21) 24.27,48.23 U2.6 ; v1(16.38,44.32) 16.28,44.23 v1(16.28,37.43)
  Bottom Layer w0.152: v1(16.38,44.32) 19.77,44.32 22.95,47.5 23.16,47.5 23.88,48.21 v1(24.26,48.21) ; v1(17.53,30.86) 14.48,30.86 13.84,31.5 13.84,33.53 16.28,35.97 v1(16.28,37.43)
PA10: length 37.2
  Top Layer w0.152: U1.31 14.6,30.86 14.3,30.55 v1(14.3,29.72) ; v1(16.38,15.49) 32.14,15.49 34.55,13.08
  Bottom Layer w0.152: v1(16.38,15.49) 16.38,19.18 14.99,20.57 14.99,27.81 14.3,28.5 v1(14.3,29.72)
PA13: length 32.6
  Top Layer w0.152: CN1.3 35.45,39.23 34.29,40.39 v1(21.46,40.39) ; U1.34 17.28,32.36 17.48,32.56 17.93,32.56 18.35,32.13 21.08,32.13 v1(21.46,31.75)
  Bottom Layer w0.152: v1(21.46,31.75) 21.46,31.76 v1(21.46,40.39)
PA14: length 35.1
  Top Layer w0.152: U1.37 14.81,35.73 13.21,37.34 13.21,38.61 v1(12.9,38.91) ; CN1.5 38.26,38.35 35.31,38.35 33.85,39.81 21.28,39.81 20.83,40.26 v1(20.83,41.66)
  Bottom Layer w0.152: v1(12.9,38.91) 15.65,41.66 v1(20.83,41.66)
PB2: length 55.9
  Top Layer w0.152: v1(31.88,18.29) 31.37,18.8 27.31,18.8 26.54,18.03 18.8,18.03 v1(16.38,20.45) ; v1(15.75,22.35) 14.6,22.35 12.81,24.14 U1.20 ; SW2.1 42.35,19.11 v1(41.47,18.22)
  Top Layer w0.254: SW2.2 SW2.1
  Bottom Layer w0.152: v1(31.88,18.29) 32.77,17.4 40.64,17.4 v1(41.47,18.22) 41.53,18.29 41.53,24.64 40.89,25.27 37.34,25.27 36.68,24.61 35.69,24.61 35.03,25.27 R14.2 ; v1(15.75,22.35) 15.75,21.08 v1(16.38,20.45)
PB12: length 2.3
  Top Layer w0.254: v1(27.43,1.52) R9.2
  Bottom Layer w0.254: 26.37,1.23 26.63,1.5 27.41,1.5 v1(27.43,1.52)
PB13: length 2.7
  Top Layer w0.254: R10.2 v1(27.18,3.81)
  Bottom Layer w0.254: v1(27.18,3.81) 26.37,3 U4.7
XI: length 10.4
  Top Layer w0.152: U2.10 25.13,53.32 R8.2 26.42,57.02 27.56,58.17 28.51,58.17 C20.1 30.3,56.5 X2.1
XO: length 6.1
  Top Layer w0.152: U2.9 26.01,52.82 26.54,53.35 28.01,53.35 28.64,53.98 28.64,55.26
$1N37: length 2.5
  Top Layer w0.152: U1.44 11.31,36.57 R2.1
$1N71: length 1.8
  Top Layer w0.254: R26.1 14.11,8.02 LED4.1
$1N72: length 1.8
  Top Layer w0.254: R25.1 LED3.1
$1N73: length 1.5
  Top Layer w0.254: LED1.1 14.22,55.4 R23.1
$1N74: length 1.7
  Top Layer w0.254: R24.1 34.28,55.6 LED2.1
$1N90: length 1.7
  Top Layer w0.254: R27.2 26.79,22.33 Q5.3
$1N91: length 2.2
  Top Layer w0.254: Q5.1 24.34,20.57 R29.1
$2N4: length 1.7
  Top Layer w0.254: C8.1 21.49,32.55 U3.20
$2N8: length 2.5
  Top Layer w0.254: C11.2 27.88,33.61 26.99,32.73 26.99,32.38 26.75,32.13 26.4,32.13 U3.10
$2N10: length 1.6
  Top Layer w0.254: U3.9 27.49,31.55 R6.2
$3N1: length 1.5
  Top Layer w0.152: R7.1 20.12,53.47 U2.16
$3N4: length 1.8
  Top Layer w0.152: 20.27,51.82 19.56,51.82 19.05,51.31 C13.2
$3N16: length 1.7
  Top Layer w0.152: C18.2 19.43,57.21 19.49,57.15
$3N19: length 3.6
  Top Layer w0.152: L1.1 20.89,57.15 L2.2 20.89,55.7 21.65,54.95 22.01,54.95 22.14,54.81 22.14,54.45 U2.13
$3N20: length 3.7
  Top Layer w0.152: U2.12 22.77,55.65 22.29,56.13 23.94,56.13
$3N21: length 6
  Top Layer w0.152: C17.2 25.34,57.34 L3.2 23.9,54.32 U2.11
$5N1: length 15.4
  Top Layer w0.254: v1(43.94,29.72) 39.75,29.72 36.32,33.15 LED6.2 LED5.1
  Bottom Layer w0.254: v1(43.94,29.72) 41.64,29.72 U5.2
$5N2: length 21.2
  Top Layer w0.254: 33.88,35.69 LED6.1 LED8.1 33.91,28.42 33.91,27.31 34.29,26.92 36.45,26.92 37.21,27.69 43.43,27.69 v1(43.81,27.31)
  Bottom Layer w0.254: v1(43.81,27.31) 41.54,27.31 U5.4
$5N3: length 13.6
  Top Layer w0.254: LED7.1 LED8.2 v1(43.94,28.45)
  Bottom Layer w0.254: U5.3 41.64,28.45 v1(43.94,28.45)
$5N5: length 1.8
  Bottom Layer w0.508: R13.2 C25.1
$5N10: length 3
  Bottom Layer w0.254: 33.21,29.72 33.32,29.83 U5.7
$5N11: length 2
  Bottom Layer w0.254: R14.1 36.19,27.27 U5.5
$6N2: length 4.8
  Top Layer w0.254: FPC1.1 8.38,48.98 8.38,48.19 8.56,48.01 9.89,48.01 Q1.3
$6N7: length 3.6
  Top Layer w0.254: Q1.1 11.24,51.51 R16.2 12.68,51.95 R15.2
$6N10: length 3.3
  Top Layer w0.254: R17.2 R18.2 37.68,48.25 Q2.1
$6N12: length 3.9
  Top Layer w0.254: Q2.3 39.74,47.99 40.26,48.51 41.19,48.51 FPC2.1
$6N15: length 3.2
  Top Layer w0.254: R20.2 8.25,19.94 R19.2 8.25,18.47 Q3.1
$6N17: length 2.5
  Top Layer w0.254: FPC3.1 6.3,14.31 7.24,15.24 Q3.3
$6N20: length 3.4
  Top Layer w0.254: R21.2 36.07,12.56 R22.2 37.85,14.05 37.78,14.11
$6N22: length 5.4
  Top Layer w0.254: FPC4.1 40.77,14.27 40.77,16.26 40.59,16.44 39.06,16.44 Q4.3

## Copper pours and planes (outline as drawn; the poured copper is in the pictures)
3V3 on Top Layer: 27.94,48.77 29.46,48.77 29.46,47.88 27.94,47.88
3V3 on Top Layer: 7.1,39.78 8.76,39.78 8.76,36.05 7.1,36.05
3V3 on Top Layer: 15.49,27.35 16.89,27.35 16.89,24.53 15.49,24.53
3V3 on Top Layer: 18.97,38.48 29.56,38.48 29.56,37.15 18.97,37.15
3V3 on Top Layer: 6,27.38 7.62,27.38 7.62,25.65 6,25.65
3V3 on Top Layer: 25.2,52.13 28.4,52.13 28.4,51.05 25.2,51.05
3V3 on Bottom Layer: 27.94,48.77 29.46,48.77 29.46,37.06 27.94,37.06
3V3 on Bottom Layer: 27.75,38.61 32.38,38.61 32.38,33.66 27.75,33.66
3V3 on Bottom Layer: 7.1,39.78 9.14,39.78 9.14,35.94 7.1,35.94
3V3 on Bottom Layer: 18.72,38.48 19.81,38.48 19.81,27.69 18.72,27.69
3V3 on Bottom Layer: 15.49,27.31 16.89,27.31 16.89,24.53 15.49,24.53
3V3 on Bottom Layer: 21.08,15.24 23.24,15.24 23.24,13.34 21.08,13.34
3V3 on Bottom Layer: 6,27.38 7.62,27.38 7.62,25.65 6,25.65
+5V on Bottom Layer: 32.79,31.88 37.08,31.88 37.08,30.75 32.79,30.75
+5V on Bottom Layer: 32.67,33.78 34.42,33.78 34.42,30.75 32.67,30.75
GND on Top Layer: -1.52,69.34 50.55,69.34 50.55,-1.4 -1.52,-1.4
GND on Bottom Layer: -1.78,68.07 53.85,68.07 53.85,-2.16 -1.78,-2.16
VBAT on Top Layer: 28.34,17.68 30.54,17.68 30.54,16.66 28.34,16.66
VBAT on Top Layer: 28.34,25.69 30.61,25.69 30.61,23.62 28.34,23.62
VBAT on Bottom Layer: 30.79,30.48 32.26,30.48 32.26,27.84 30.79,27.84
VBAT on Bottom Layer: 28.34,27.56 30.54,27.56 30.54,16.66 28.34,16.66
VBAT on Bottom Layer: 30.79,28.96 37.08,28.96 37.08,27.84 30.79,27.84
VBAT on Bottom Layer: 23.11,47.24 24.51,47.24 24.51,46.36 23.11,46.36
VCC on Bottom Layer: 40.64,36.07 42.42,36.07 42.42,30.61 40.64,30.61
AT1 on Top Layer: 27.6,65.06 28.1,65.06 28.1,62.24 27.6,62.24
AT1 on Top Layer: 25.41,62.74 27.9,62.74 27.9,62.24 25.41,62.24
AT1 on Top Layer: 23.5,65.38 25.9,65.38 25.9,64.88 23.5,64.88
AT1 on Top Layer: 17.6,65.38 21.8,65.38 21.8,64.88 17.6,64.88
AT1 on Top Layer: 23.5,65.06 24,65.06 24,62.24 23.5,62.24
AT1 on Top Layer: 27.6,65.38 29.9,65.38 29.9,64.88 27.6,64.88
AT1 on Top Layer: 21.3,65.06 21.8,65.06 21.8,62.24 21.3,62.24
AT1 on Top Layer: 21.39,62.73 23.93,62.73 23.93,62.24 21.39,62.24
AT1 on Top Layer: 25.4,65.06 25.9,65.06 25.9,62.24 25.4,62.24
AT1 on Top Layer: 29.4,65.06 29.9,65.06 29.9,60.94 29.4,60.94
AT1 on Top Layer: 19.3,65.11 19.8,65.11 19.8,59.78 19.3,59.78
AT1 on Top Layer: 17.6,65.08 18.5,65.08 18.5,59.78 17.6,59.78

Small or netless copper shapes (teardrops, artwork), in the pictures only: 324 on Top Layer, 97 on Bottom Layer

## Text on the board
Bottom Silkscreen Layer: Triple-J
